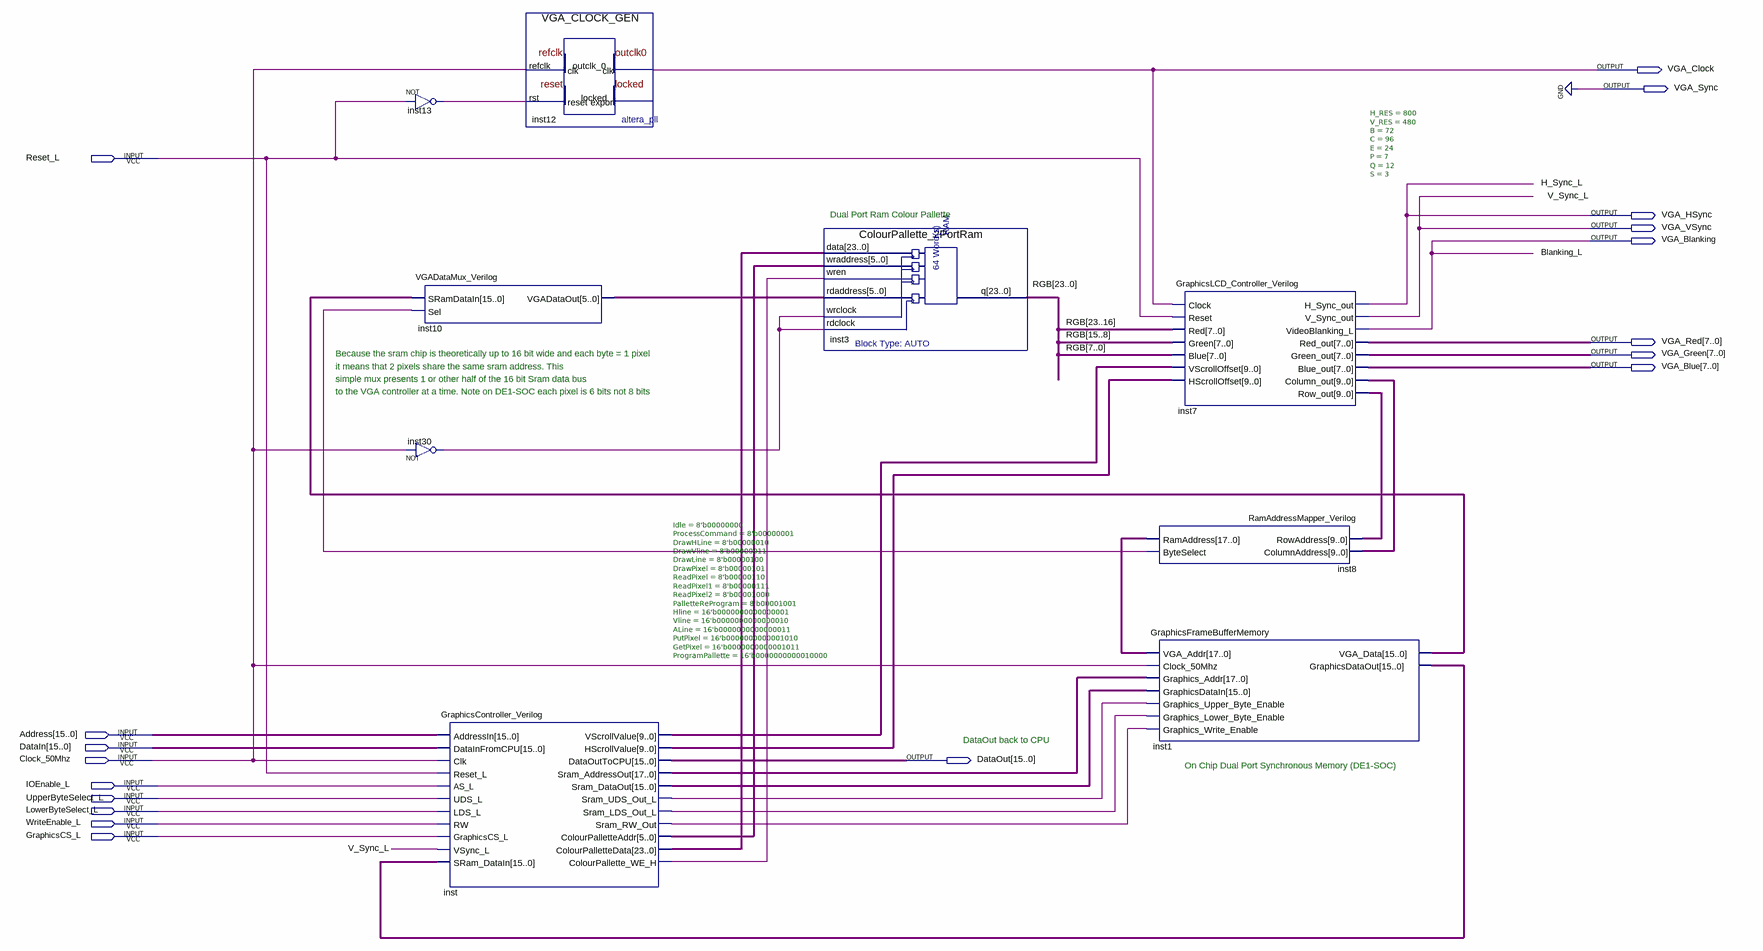
[diagram p0: schematic sheet]
// Quartus schematic Graphics_and_Video_Controller.bdf as structural Verilog: 9 symbols, 18 pins
module Graphics_and_Video_Controller (
  input  Reset_L,
  input  [15:0] Address,
  input  [15:0] DataIn,
  input  Clock_50Mhz,
  input  IOEnable_L,
  input  UpperByteSelect_L,
  input  LowerByteSelect_L,
  input  WriteEnable_L,
  input  GraphicsCS_L,
  output VGA_Clock,
  output VGA_Sync,
  output VGA_HSync,
  output VGA_VSync,
  output VGA_Blanking,
  output [7:0] VGA_Red,
  output [7:0] VGA_Green,
  output [7:0] VGA_Blue,
  output [15:0] DataOut
);

  wire inst8_byteselect, inst13_out, inst30_out, inst_colourpallette_we_h, inst_sram_lds_out_l,
       inst_sram_rw_out, inst_sram_uds_out_l;
  wire [5:0] inst10_vgadataout, inst_colourpalletteaddr;
  wire [9:0] inst7_column_out, inst7_row_out, inst_hscrollvalue, inst_vscrollvalue;
  wire [15:0] inst1_graphicsdataout, inst1_vga_data, inst_sram_dataout;
  wire [17:0] inst8_ramaddress, inst_sram_addressout;
  wire [23:0] inst_colourpallettedata, RGB;

  not inst13 (inst13_out, Reset_L);
  VGADataMux_Verilog inst10 (.SRamDataIn(inst1_vga_data), .Sel(inst8_byteselect), .VGADataOut(inst10_vgadataout));
  not inst30 (inst30_out, Clock_50Mhz);
  GraphicsController_Verilog #(.Idle(8'b00000000), .ProcessCommand(8'b00000001), .DrawHLine(8'b00000010), .DrawVline(8'b00000011), .DrawLine(8'b00000100), .DrawPixel(8'b00000101), .ReadPixel(8'b00000110), .ReadPixel1(8'b00000111), .ReadPixel2(8'b00001000), .PalletteReProgram(8'b00001001), .Hline(16'b0000000000000001), .Vline(16'b0000000000000010), .ALine(16'b0000000000000011), .PutPixel(16'b0000000000001010), .GetPixel(16'b0000000000001011), .ProgramPallette(16'b0000000000010000)) inst (
    .AddressIn(Address), .DataInFromCPU(DataIn), .Clk(Clock_50Mhz), .Reset_L(Reset_L), .AS_L(IOEnable_L),
    .UDS_L(UpperByteSelect_L), .LDS_L(LowerByteSelect_L), .RW(WriteEnable_L), .GraphicsCS_L(GraphicsCS_L),
    .VSync_L(VGA_VSync), .SRam_DataIn(inst1_graphicsdataout), .VScrollValue(inst_vscrollvalue),
    .HScrollValue(inst_hscrollvalue), .DataOutToCPU(DataOut), .Sram_AddressOut(inst_sram_addressout),
    .Sram_DataOut(inst_sram_dataout), .Sram_UDS_Out_L(inst_sram_uds_out_l),
    .Sram_LDS_Out_L(inst_sram_lds_out_l), .Sram_RW_Out(inst_sram_rw_out),
    .ColourPalletteAddr(inst_colourpalletteaddr), .ColourPalletteData(inst_colourpallettedata),
    .ColourPallette_WE_H(inst_colourpallette_we_h));
  VGA_CLOCK_GEN inst12 (.refclk(Clock_50Mhz), .rst(inst13_out), .outclk_0(VGA_Clock));  // open: locked
  ColourPallette_2PortRam inst3 (
    .data(inst_colourpallettedata), .wraddress(inst_colourpalletteaddr), .wren(inst_colourpallette_we_h),
    .rdaddress(inst10_vgadataout), .wrclock(inst30_out), .rdclock(inst30_out), .q(RGB));
  GraphicsLCD_Controller_Verilog #(.H_RES(800), .V_RES(480), .B(72), .C(96), .E(24), .P(7), .Q(12), .S(3)) inst7 (
    .Clock(VGA_Clock), .Reset(Reset_L), .Red(RGB[23:16]), .Green(RGB[15:8]), .Blue(RGB[7:0]),
    .VScrollOffset(inst_vscrollvalue), .HScrollOffset(inst_hscrollvalue), .H_Sync_out(VGA_HSync),
    .V_Sync_out(VGA_VSync), .VideoBlanking_L(VGA_Blanking), .Red_out(VGA_Red), .Green_out(VGA_Green),
    .Blue_out(VGA_Blue), .Column_out(inst7_column_out), .Row_out(inst7_row_out));
  RamAddressMapper_Verilog inst8 (
    .RowAddress(inst7_row_out), .ColumnAddress(inst7_column_out), .RamAddress(inst8_ramaddress),
    .ByteSelect(inst8_byteselect));
  GraphicsFrameBufferMemory inst1 (
    .VGA_Addr(inst8_ramaddress), .Clock_50Mhz(Clock_50Mhz), .Graphics_Addr(inst_sram_addressout),
    .GraphicsDataIn(inst_sram_dataout), .Graphics_Upper_Byte_Enable(inst_sram_uds_out_l),
    .Graphics_Lower_Byte_Enable(inst_sram_lds_out_l), .Graphics_Write_Enable(inst_sram_rw_out),
    .VGA_Data(inst1_vga_data), .GraphicsDataOut(inst1_graphicsdataout));

  assign VGA_Sync = 1'b0;

  // Other names for the same wires on the sheet: Blanking_L = VGA_Blanking; H_Sync_L = VGA_HSync;
  //   V_Sync_L = VGA_VSync

  // Notes on the sheet:
  //   Dual Port Ram Colour Pallette
  //   Because the sram chip is theoretically up to 16 bit wide and each byte = 1 pixel
  //   it means that 2 pixels share the same sram address. This
  //   simple mux presents 1 or other half of the 16 bit Sram data bus 
  //   to the VGA controller at a time. Note on DE1-SOC each pixel is 6 bits not 8 bits
  //   DataOut back to CPU
  //   On Chip Dual Port Synchronous Memory (DE1-SOC)
endmodule
